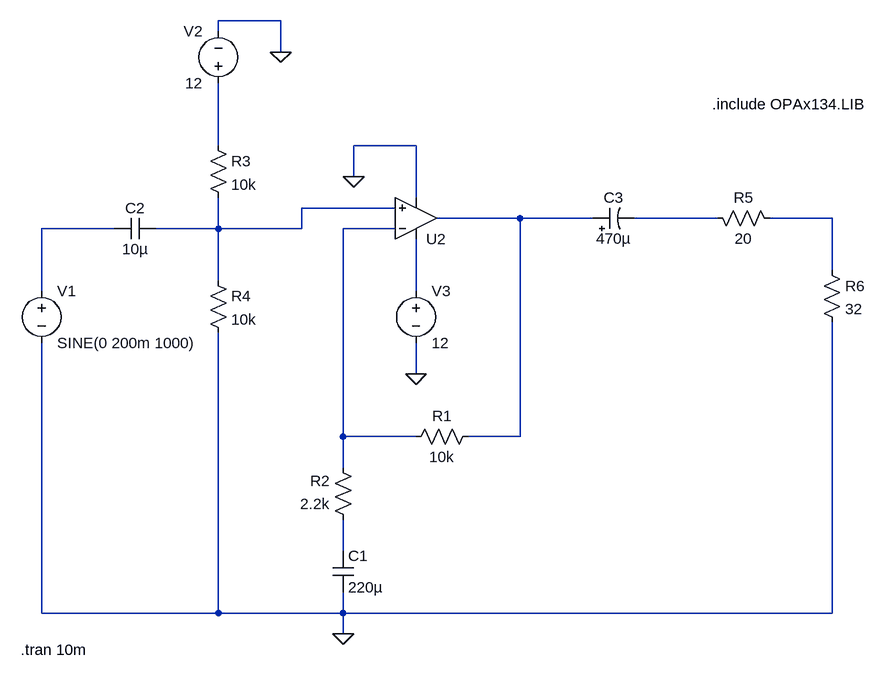
[diagram p0: schematic Draft2.asc]
Draft2.asc, the LTspice schematic file:
Version 4.1
SHEET 1 1348 840
WIRE -16 -144 -112 -144
WIRE -112 -128 -112 -144
WIRE -16 -96 -16 -144
WIRE -112 48 -112 -48
WIRE 192 48 96 48
WIRE 96 96 96 48
WIRE 192 128 192 48
WIRE 160 144 16 144
WIRE 352 160 224 160
WIRE 464 160 352 160
WIRE 656 160 528 160
WIRE 832 160 736 160
WIRE -272 176 -384 176
WIRE -112 176 -112 128
WIRE -112 176 -208 176
WIRE 16 176 16 144
WIRE 16 176 -112 176
WIRE 160 176 80 176
WIRE 832 240 832 160
WIRE -112 256 -112 176
WIRE -384 272 -384 176
WIRE 192 272 192 192
WIRE 192 400 192 352
WIRE 80 496 80 176
WIRE 192 496 80 496
WIRE 352 496 352 160
WIRE 352 496 272 496
WIRE 80 544 80 496
WIRE 80 672 80 624
WIRE -384 768 -384 352
WIRE -112 768 -112 336
WIRE -112 768 -384 768
WIRE 80 768 80 736
WIRE 80 768 -112 768
WIRE 832 768 832 320
WIRE 832 768 80 768
WIRE 80 800 80 768
FLAG -16 -96 0
FLAG 96 96 0
FLAG 192 400 0
FLAG 80 800 0
SYMBOL res -128 32 R0
SYMATTR InstName R3
SYMATTR Value 10k
SYMBOL res -128 240 R0
SYMATTR InstName R4
SYMATTR Value 10k
SYMBOL cap -208 160 R90
WINDOW 0 0 32 VBottom 2
WINDOW 3 32 32 VTop 2
SYMATTR InstName C2
SYMATTR Value 10µ
SYMBOL voltage -384 256 R0
WINDOW 123 24 124 Left 2
WINDOW 39 0 0 Left 0
SYMATTR InstName V1
SYMATTR Value SINE(0 200m 1000)
SYMBOL voltage -112 -32 R180
WINDOW 0 24 96 Left 2
WINDOW 3 24 16 Left 2
WINDOW 123 0 0 Left 0
WINDOW 39 0 0 Left 0
SYMATTR InstName V2
SYMATTR Value 12
SYMBOL voltage 192 256 R0
WINDOW 123 0 0 Left 0
WINDOW 39 0 0 Left 0
SYMATTR InstName V3
SYMATTR Value 12
SYMBOL res 288 480 R90
WINDOW 0 0 56 VBottom 2
WINDOW 3 32 56 VTop 2
SYMATTR InstName R1
SYMATTR Value 10k
SYMBOL res 96 640 R180
WINDOW 0 36 76 Left 2
WINDOW 3 36 40 Left 2
SYMATTR InstName R2
SYMATTR Value 2.2k
SYMBOL cap 64 672 R0
SYMATTR InstName C1
SYMATTR Value 220µ
SYMBOL res 640 144 M90
WINDOW 0 0 56 VBottom 2
WINDOW 3 32 56 VTop 2
SYMATTR InstName R5
SYMATTR Value 20
SYMBOL res 816 224 R0
SYMATTR InstName R6
SYMATTR Value 32
SYMBOL polcap 464 176 R270
WINDOW 0 32 32 VTop 2
WINDOW 3 0 32 VBottom 2
SYMATTR InstName C3
SYMATTR Value 470µ
SYMBOL OpAmps\\UniversalOpAmp2 192 160 M180
SYMATTR InstName U2
TEXT 648 -16 Left 2 !.include OPAx134.LIB
TEXT -416 824 Left 2 !.tran 10m

The netlist it stands for:
* Draft2.asc
R3 N001 N002 10k
R4 N002 0 10k
C2 N002 N006 10µ
V1 N006 0 SINE(0 200m 1000)
V2 N001 0 12
V3 N008 0 12
R1 N003 N007 10k
R2 N009 N007 2.2k
C1 N009 0 220µ
R5 N004 N005 20
R6 N005 0 32
C3 N003 N004 470µ
X§U2 N002 N007 N008 0 N003 level2 Avol=1Meg GBW=10Meg Slew=10Meg Ilimit=25m Rail=0 Vos=0 En=0 Enk=0 In=0 Ink=0 Rin=500Meg  ; pins In+ In- V+ V- OUT
.include OPAx134.LIB
.tran 10m
.lib UniversalOpAmp2.lib
.backanno
.end